# Altium schematic sheet Power.SchDoc: Power
size A4; DrawnBy: Peyman Moein; Revision: 1; SheetNumber: 1; SheetTotal: 7
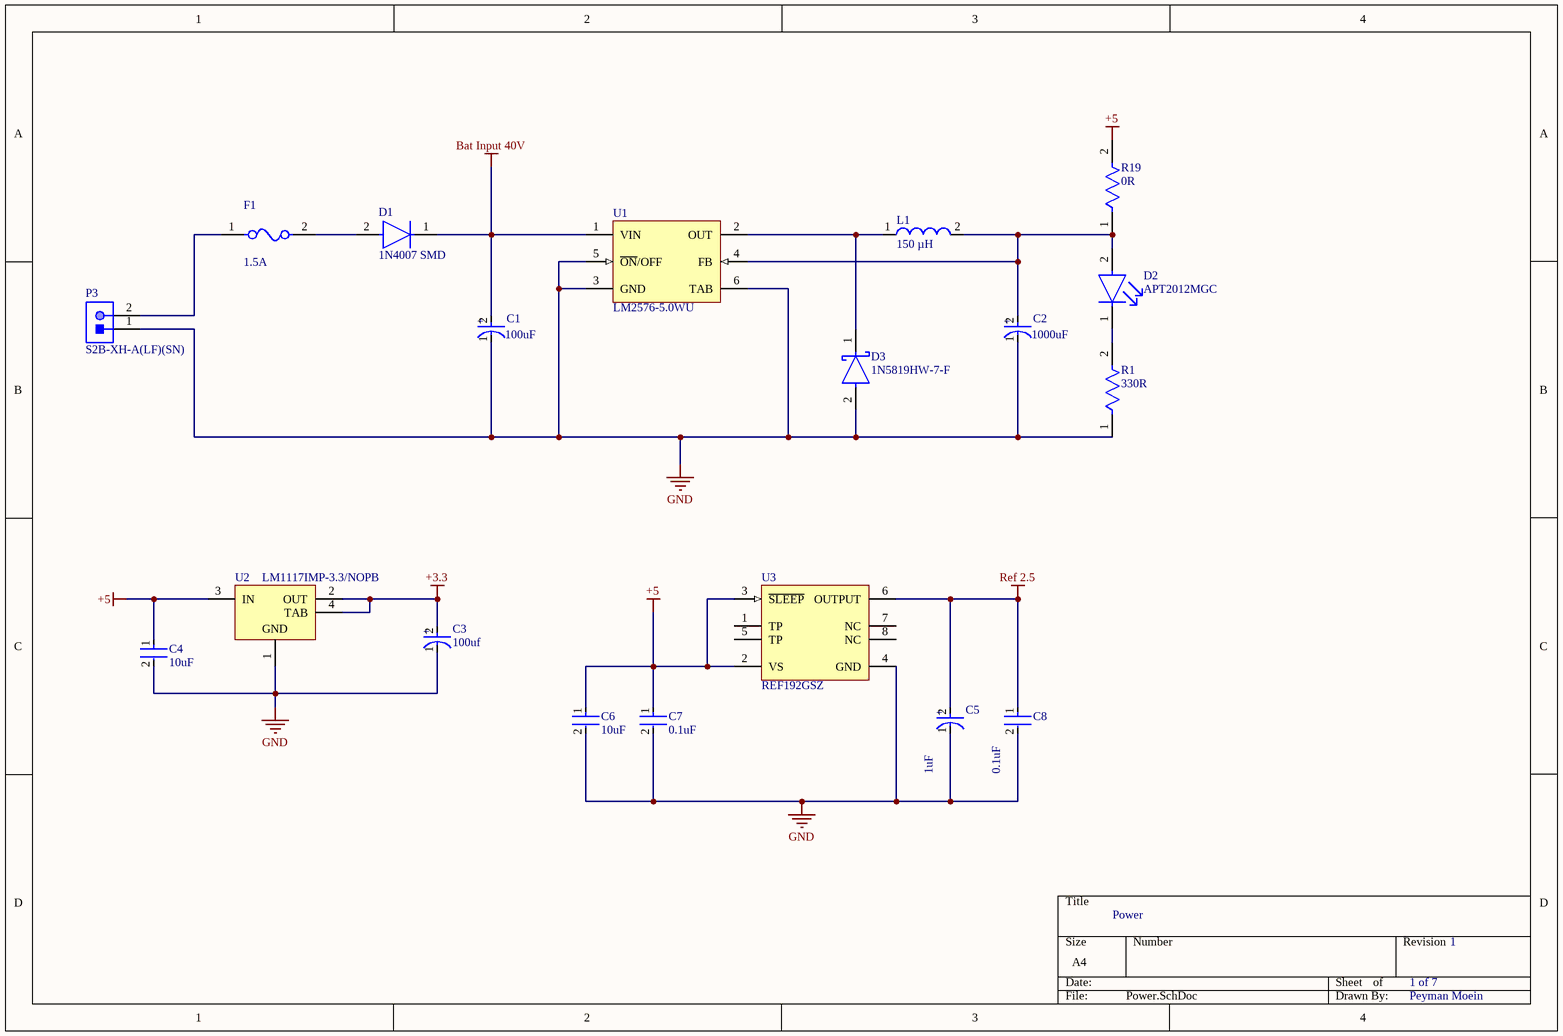
[diagram p0: Power.SchDoc]

## Parts
C1  100uF  [FP-UWT1H101MNL1GS-MFG]
C2  1000uF  [FP-SVPF-F12-MFG]
C3  100uf  [FP-SC-MFG]
C4  10uF  [FP-GRM21B-0_1-IPC_C]
C5  1uF  [FP-T491A105K016AT-MFG]
C6  10uF  [FP-GRM21B-0_1-IPC_C]
C7  0.1uF  [FP-C0805C-DN-MFG]
C8  0.1uF  [FP-C0805C-DN-MFG]
D1  1N4007 SMD  [FP-1N4007_SMD-IPC_C]
D2  APT2012MGC  [FP-APT2012MGC-MFG]
D3  1N5819HW-7-F  [FP-SOD123-IPC_A]
F1  1.5A  [FP-0679H-MFG]
L1  150 µH  [WE-PD-XL]
P3  S2B-XH-A(LF)(SN)  [JST-S2B-XH-A(LF)(SN)_V]
R1  330R  [FP-CRCW0805-e3-MFG]
R19  0R  [FP-CRCW0805-e3-MFG]
U1  LM2576-5.0WU  [FP-TO263-5LD-PL-1-MFG]
U2  LM1117IMP-3.3/NOPB  [DCY0004A_N]
U3  REF192GSZ  [ADI-R-8_M]

## Nets
+3.3: C3.2(A) U2.2(OUT) U2.4(TAB)
+5: C4.1 C6.1 C7.1 R19.2 U2.3(IN) U3.2(VS) U3.3(~{SLEEP})
Bat Input 40V: C1.2(A) D1.1(C) U1.1(VIN)
GND: C1.1(C) C2.1(C) C3.1(C) C4.2 C5.1(C) C6.2 C7.2 C8.2 D3.2(A) P3.1 R1.1 U1.3(GND) U1.5(~{ON}/OFF) U1.6(TAB) U2.1(GND) U3.4(GND)
Ref 2.5: C5.2(A) C8.1 U3.6(OUTPUT)
NetC2_2: C2.2(A) D2.2(A) L1.2 R19.1 U1.4(FB)
NetD1_2: D1.2(A) F1.2
NetD2_1: D2.1(C) R1.2
NetD3_1: D3.1(C) L1.1 U1.2(OUT)
NetF1_1: F1.1 P3.2

Not connected (* = marked no-connect by the designer): U3 1(TP) 5(TP) 7(NC) 8(NC)

## Notes on the sheet
- Power
- 1 of 7
- 1
- Peyman Moein
- (in symbol CMP-2000-07186-2) +
- (in symbol CMP-2000-07373-2) +
- (in symbol CMP-05427-000027-1) +
- (in symbol CMP-05427-000075-1) +

## Library data of the parts
C1 = CMP-2000-07373-2: C445063; Tolerance: 20%; Voltage Rating: 50V; Leakage Current: 3uA; Ripple Current: 140mA; Life (Hours): 1000Hour; Dissipation Factor: 0.14%; Dielectric Material: Aluminium; Termination: SMD/SMT; Package Quantity: 500; Capacitance: 100uF; Height: 10mm; REACH SVHC: No SVHC; Case/Package: Radial; Series: WT; Diameter: 8mm; Construction: Cylindrical; Length: 10mm; Min Operating Temperature: -55°C; Max Operating Temperature: 105°C; Voltage Rating (DC): 50V; Packaging: Tape and Reel; Voltage: 50V; Mount: Surface Mount; Ripple Current (AC): 140mA; Radiation Hardening: No; Number of Pins: 2; Lead Free: Lead Free; Height - Seated (Max): 0.413inch; RoHS Compliant: Yes
C2 = CMP-05427-000075-1: C236289; Ripple Current (AC): 5.4A; Dissipation Factor: 12%; Life (Hours): 5000Hour; Capacitance: 1mF; Voltage: 16V; Tolerance: 20%; Leakage Current: 3.2mA; Polarity: Polar; ESR (Equivalent Series Resistance): 12mR; Lead Free: Lead Free; Ripple Current: 5.4A; Min Operating Temperature: -55°C; Radiation Hardening: No; Diameter: 10mm; Case/Package: Radial; Max Operating Temperature: 105°C; Mount: Surface Mount; Termination: SMD/SMT; Height: 12.6mm; Height - Seated (Max): 0.5inch; Package Quantity: 400; Length: 12.6mm; Packaging: Tape and Reel; Voltage Rating (DC): 16V; Voltage Rating: 16V; REACH SVHC: No SVHC; Number of Pins: 12; RoHS Compliant: Yes
C3 = CMP-05427-000027-1: C128464; Ripple Current: 300mA; Voltage: 35V; Polarity: Polar; Life (Hours): 2000Hour; Lead Diameter: 0.65mm; Tolerance: 20%; ESR (Equivalent Series Resistance): 260mR; Leakage Current: 35uA; REACH SVHC: No SVHC; Series: FT; Min Operating Temperature: -55°C; Diameter: 6.3mm; Max Operating Temperature: 105°C; Number of Pins: 2; Package Quantity: 1000; Length: 5.8mm; Lead Pitch: 1.8mm; Construction: Cylindrical; Capacitance: 100uF; Height: 5.8mm; RoHS Compliant: Yes; Packaging: Tape and Reel; Ripple Current (AC): 300mA; Height - Seated (Max): 0.24inch; Voltage Rating: 35V; Radiation Hardening: No; Contact Plating: Tin; Termination: SMD/SMT; Voltage Rating (DC): 35V; Case/Package: Radial; Mount: Surface Mount
C4 C6 = CMP-2007-03453-2: C77075; Voltage Rating (DC): 16V; Dielectric: X5R; Tolerance: 10%; Material: Ceramic; Radiation Hardening: No; Thickness: 0.053inch; Lead Free: Lead Free; Package Quantity: 1; Width: 1.25mm; Case Code (Imperial): 0805; Depth: 1.25mm; Packaging: Tape and Reel; Max Operating Temperature: 85°C; Voltage Rating: 16V; Voltage: 16V; Capacitance: 10uF; Height: 1.25mm; Case Code (Metric): 2012; Mount: Surface Mount; Case/Package: 0805; REACH SVHC: No SVHC; Length: 2mm; Min Operating Temperature: -55°C; Termination: SMD/SMT
C5 = CMP-2000-07186-2: C116269; Tolerance: 20%; Ripple Current: 87mA; Dielectric Material: Tantalum; Voltage: 16V; Life (Hours): 2000Hour; Dissipation Factor: 4%; ESR (Equivalent Series Resistance): 10R; Leakage Current: 500nA; Polarity: Polar; Lead Free: Lead Free; Capacitance: 1uF; Min Operating Temperature: -55°C; Number of Pins: 2; Mount: Surface Mount; Voltage Rating: 16V; Case Code (Imperial): 1206; Length: 3.2mm; Height: 1.6mm; Features: General Purpose; Max Operating Temperature: 125°C; Package Quantity: 1; REACH SVHC: No SVHC; Termination: SMD/SMT; Depth: 1.6mm; Width: 1.6mm; Packaging: Tape and Reel; Case Code (Metric): 3216; Case/Package: 1206; Voltage Rating (DC): 16V; Height - Seated (Max): 0.071inch
C7 C8 = CMP-2100-03606-3: C49678; Manufacturer Part Number: CC0805KRX7R9BB104; Manufacturer: Yageo; Tolerance: 0.1; Capacitance: 100 nF; Value: 100 nF; Temperature Characteristic: X7R; Voltage Rating: 50 V; Material: Ceramic; Device Class L1: Passive Components; ComponentLink2Description: Datasheet; Package: CC0805-0.85; Digikey Description: CAP CER 0.1UF 50V X7R 0805; Device Class L3: Ceramic Capacitors; Temperature: -30°C to +85°C; Height: 0.95mm; RoHS: TRUE; Ipc Land Pattern Name: CAPC200125X85; Device Class L2: Capacitors; Category: Cap; Temperature Range Low: -30°C; Temperature Range High: +85°C; Mouser Description: Multilayer Ceramic Capacitors MLCC - SMD/SMT 100nF 50V X7R 10%; Footprint Url: http://www.yageo.com/exep/pages/download/literatures/UPY-C_GEN_24.pdf; Automotive: No; Octopart: https://octopart.com/cc0805krx7r9bb104-yageo-192993; Lead Free: Yes; ComponentLink2URL: http://www.yageo.com/documents/recent/UPY-GPHC_Y5V_6.3V-to-50V_8.pdf
D1 = CMP-12389-000001-1: C727081
D2 = CMP-1426-00010-2: C138557; Forward Voltage: 1.9V; Luminous Intensity: 60mcd; Dominant Wavelength: 630nm; Forward Current: 30mA; Viewing Angle: 140°; Lens Color: Colorless; Lens Style: Clear; Test Current: 20mA; Color: Red; Lens Size: 1.25mm; Packaging: Cut Tape; Width: 1.25mm; Case Code (Metric): 2012; Max Operating Temperature: 85°C; RoHS Compliant: Yes; Mount: Surface Mount; Case/Package: 0805; Series: WL-SMCW; Length: 2mm; Case Code (Imperial): 0805; Wavelength: 630nm; Min Operating Temperature: -40°C; Lens Transparency: Clear; Package Quantity: 1; Height: 0.8mm
D3 = CMP-0303-00003-3: DIODE SCHOTTKY 40V 1A SOD123; Forward Voltage: 450mV; Capacitance: 110pF; Max Forward Surge Current (Ifsm): 25A; Peak Reverse Current: 50uA; Polarity: Standard; Element Configuration: Single; Max Power Dissipation: 450mW; Min Operating Temperature: -65°C; Package Quantity: 3000; Contact Plating: Tin; Weight: 0.000353oz; Max Repetitive Reverse Voltage (Vrrm): 40V; Max Reverse Voltage (DC): 40V; Height: 1.25mm; Average Rectified Current: 1A; Width: 1.7mm; Case/Package: SOD-123-2; Lead Free: Lead Free; Max Operating Temperature: 125°C; Current Rating: 1A; Termination: SMD/SMT; Forward Current: 1A; Radiation Hardening: No; Number of Pins: 2; Length: 2.85mm; Voltage Rating (DC): 40V; REACH SVHC: No SVHC; Peak Non-Repetitive Surge Current: 25A; Packaging: Tape and Reel; Output Current: 1A
F1 = CMP-2000-05188-2: C178994; Manufacturer Part Number: 0448005.MR; Manufacturer: Littelfuse; Max Fuse Ac Voltage: 125V; Fuse Blow Speed: Fast; Fuse Current: 5A; Fuse Interrupt Ac Current: 50A; Value: 0.01531Ω; Fuse I2T: 4.49A2Sec; Device Class L3: unset; Lead Free: Yes; RoHS: TRUE; Max Fuse Dc Voltage: 125V; Mouser Description: Fuse Chip Very Fast Acting 5A 125V SMD Solder Pad 2410 Ceramic T/R CSA/PSE/UL; Package: 0448; Device Class L2: Fuses; Device Class L1: Circuit Protection; Octopart: https://octopart.com/0448005.mr-littelfuse-672815; ComponentLink2URL: https://www.littelfuse.com/~/media/electronics/datasheets/fuses/littelfuse_fuse_448_datasheet.pdf.pdf; Automotive: No; Digikey Description: FUSE BRD MNT 5A 125VAC/VDC 2SMD; Resistance: 0.01531Ω; Fuse Interrupt Dc Current: 50A; Temperature Range High: +125°C; Temperature: -55°C to +125°C; Voltage Rating: 125V; Category: Fuse; Height: 2.94mm; ComponentLink2Description: Datasheet; Temperature Range Low: -55°C
L1 = CMP-0227-00206-1: C169397; Inductance: 150 ÂµH; PackageVersion: 2004; ComponentLink2URL: http://www.we-online.de/katalog/media/pdf/744770215.pdf; DatasheetVersion: ver 1, Jan-2006; ComponentLink1Description: Manufacturer Link; ComponentLink2Description: Datasheet; PackageDescription: SMD Inductor, 2-Leads, Body 12.0 x 12.0 mm; ComponentLink1URL: http://www.we-online.com; PackageReference: WE-PD-XL
P3 = CMP-1755-00005-1: C157931; Type (Capacitors): X7R; Voltage Rating (DC): 100 V; Tolerance: 10%; Capacitance: 1 nF; Case\Package: Radial; Min Operating Temperature: -55 degC; Mount: Through Hole; Package Quantity: 500; PackageReference: S2B-XH-A(LF)(SN); ComponentLink1Description: Manufacturer URL; Max Operating Temperature: 125 degC; ComponentLink2Description: Datasheet; RoHSCompliant: true; PackageDescription: Male Header, Pitch 2.5 mm, 1 x 2 Position, Height 6.1 mm, Tail Length 3.4 mm; REACH SVHC: No SVHC; Packaging: Bulk; Width: 3.81 mm; Length: 5.33 mm; Height: 2.54 mm; Pins: 2; Radiation Hardening: No; ComponentLink1URL: http://www.jst.com/home2.html; Lead Pitch: 2.54 mm; DatasheetVersion: May-16; Voltage Rating: 100 V; ComponentLink2URL: http://www.jst-mfg.com/product/pdf/eng/eXH.pdf
R1 = CMP-02407-004193-1: C17630; Tolerance: 1%; Resistance: 2.94R; Max Power Dissipation: 125mW; Temperature Coefficient: 100ppm/°C; Voltage Rating: 150V; Case/Package: 0805; Radiation Hardening: No; Width: 0.049inch; Packaging: Tape and Reel; Height: 0.02inch; Case Code (Imperial): 0805; Length: 2mm; Termination: SMD/SMT; Lead Free: Lead Free; Weight: 0.000194oz; Features: Automotive AEC-Q200; Min Operating Temperature: -55°C; Case Code (Metric): 2012; Contact Plating: Tin; Composition: Thick Film; Military Standard: Not; Number of Terminations: 2; Depth: 1.25mm; Package Quantity: 10; Max Operating Temperature: 155°C; Power Rating: 125mW
R19 = CMP-02407-004193-1: C25275; Tolerance: 1%; Resistance: 2.94R; Max Power Dissipation: 125mW; Temperature Coefficient: 100ppm/°C; Voltage Rating: 150V; Case/Package: 0805; Radiation Hardening: No; Width: 0.049inch; Packaging: Tape and Reel; Height: 0.02inch; Case Code (Imperial): 0805; Length: 2mm; Termination: SMD/SMT; Lead Free: Lead Free; Weight: 0.000194oz; Features: Automotive AEC-Q200; Min Operating Temperature: -55°C; Case Code (Metric): 2012; Contact Plating: Tin; Composition: Thick Film; Military Standard: Not; Number of Terminations: 2; Depth: 1.25mm; Package Quantity: 10; Max Operating Temperature: 155°C; Power Rating: 125mW
U1 = CMP-0069-00269-3: C77782; Manufacturer: Texas Instruments; PowerWise: N; CompType: Switcher; PackageTopMarking: NSUZXYTTE#*LM2596S*-5.0 P+; ComponentLink1URL: http://www.ti.com/general/docs/lit/getliterature.tsp?genericPartNumber=LM2596&fileType=pdf; PackageDescription: TO-263, Molded, .400 x .390 x .180in, 5 Lead, .067in Pitch, Surface Mount; RoHS: Y; PinCount: 5; Code_JEDEC: MO-169-AB; ComponentLink1Description: Datasheet URL; PackageReference: KTT0005B
U2 = CMP-0062-01631-4: C129334; Manufacturer: Texas Instruments; PackageTopMarking: XYTT*N05B; PowerWise: N; High-Reliability: Y; CompType: LDO IC; Code_IPC: SOT223-4; PackageReference: DCY0004A; PinCount: 4; PackageDescription: Molded SOT-223, 6.50 x 3.56 x 1.6mm Body, 4 Lead, 2.3mm Pitch; PartNumber: LM1117IMP-3.3/NOPB; RoHS: Y; ComponentLink1Description: Datasheet URL; Code_JEDEC: TO-261-AA; ComponentLink1URL: http://www.ti.com/general/docs/lit/getliterature.tsp?genericPartNumber=LM1117-N&fileType=pdf
U3 = CMP-0784-00133-1: C581299; Manufacturer: Analog Devices; Ref Out TC (ppm/C): 10; Packing: Tube; Vout: 2.5V; ComponentLink2Description: Datasheet; ComponentLink1URL: http://www.analog.com/en/index.html; PartNumber: REF192GSZ; ComponentLink4URL: Product URL:http://www.analog.com/en/special-linear-functions/voltage-references/ref192/products/product.html; ComponentLink3Description: Package Specification; PackageDescription: 8-Pin Standard Small Outline Package, Body 4.9 x 3.9 mm, Pitch 1.27 mm; ComponentLink4Description: URL Link1; Code_JEDEC: MS-012-AA; PackageReference: R-8; PackageVersion: 060506-A, 06/2006; ComponentLink2URL: http://www.analog.com/static/imported-files/data_sheets/REF19xSeries.pdf; ComponentLink1Description: Manufacturer URL; Operating Temp Range: -40 to 85 degC; DatasheetVersion: Rev. L; Mounting Technology: Surface Mount; ComponentLink3URL: http://www.analog.com/static/imported-files/packages/PKG_PDF/SOIC_Narrow%20(R)/R_8.pdf